# Altium project PID_Controller.PrjPcb
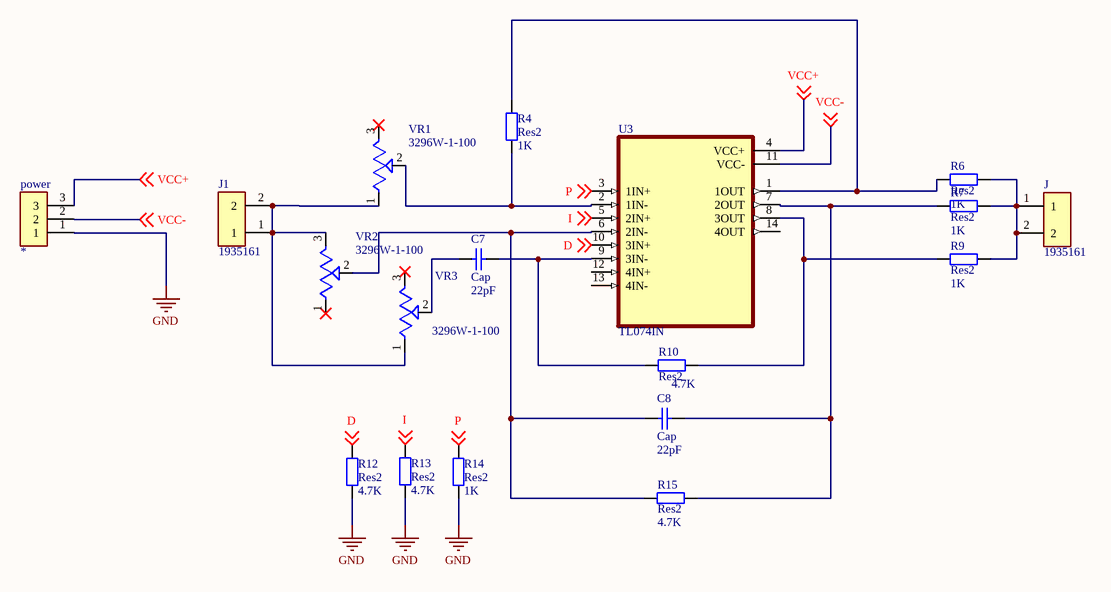
[diagram p0: PID_controller.SchDoc]
1 sheet, 18 parts. Net scope: global (net labels, ports and power ports of the same name join across sheets).
Board file: PID_controller.PcbDoc

## Sheet PID_controller.SchDoc
size A4

### Parts
C7  Cap  value 22pF  [RAD-0.3]
C8  Cap  value 22pF  [RAD-0.3]
J  1935161  [PHOENIX_1935161]
J1  1935161  [PHOENIX_1935161]
power  282837-3  [TE_282837-3]  (value not drawn)
R4  Res2  value 1K  [AXIAL-0.4]
R6  Res2  value 1K  [AXIAL-0.4]
R7  Res2  value 1K  [AXIAL-0.4]
R9  Res2  value 1K  [AXIAL-0.4]
R10  Res2  value 4.7K  [AXIAL-0.4]
R12  Res2  value 4.7K  [AXIAL-0.4]
R13  Res2  value 4.7K  [AXIAL-0.4]
R14  Res2  value 1K  [AXIAL-0.4]
R15  Res2  value 4.7K  [AXIAL-0.4]
U3  TL074IN  [DIP794W45P254L1969H508Q14]
VR1  3296W-1-100  [TRIM_3296W-1-100]
VR2  3296W-1-100  [TRIM_3296W-1-100]
VR3  3296W-1-100  [TRIM_3296W-1-100]

### Nets
GND: power.1 R12.1 R13.1 R14.1
D: R12.2 U3.10(3IN+) ; off-sheet D
I: R13.2 U3.5(2IN+) ; off-sheet I
P: R14.2 U3.3(1IN+) ; off-sheet P
VCC+: power.3 U3.4(VCC+) ; off-sheet VCC+
VCC-: power.2 U3.11(VCC-) ; off-sheet VCC-
NetC7_1: C7.1 VR3.2(WIPER)
NetC7_2: C7.2 R10.1 U3.9(3IN-)
NetC8_1: C8.1 R15.2 U3.6(2IN-) VR2.2(WIPER)
NetC8_2: C8.2 R7.1 R15.1 U3.7(2OUT)
NetJ1_1: J1.1 J1.2 VR1.1(CCW) VR2.3(CW) VR3.1(CCW)
NetJ_1: J.1 J.2 R6.2 R7.2 R9.2
NetR4_1: R4.1 U3.2(1IN-) VR1.2(WIPER)
NetR4_2: R4.2 R6.1 U3.1(1OUT)
NetR9_1: R9.1 R10.2 U3.8(3OUT)

Not connected (* = marked no-connect by the designer): U3 12(4IN+) 13(4IN-) 14(4OUT); VR1 3(CW)*; VR2 1(CCW)*; VR3 3(CW)*

### Library data of the parts
C7 C8 = Cap: Capacitor; Published: 8-Jun-2000; LatestRevisionDate: 17-Jul-2002; LatestRevisionNote: Re-released for DXP Platform.; PackageReference: RAD-0.3; Publisher: Altium Limited; PackageDescription: Radial Cap, Thru-Hole; 2 Leads; 0.3 in Pin Spacing
J J1 = 1935161: 2 Position Wire to Board Terminal Block Horizontal with Board 0.197 _5.00mm_ Through Hole; MF: Phoenix Contact; SnapEDA_Link: https://www.snapeda.com/parts/1935161/Phoenix%20Contact/view-part/423515/?ref=snap; MP: 1935161; Value: *; Digi-Key_Purchase_URL: https://www.digikey.ca/product-detail/en/phoenix-contact/1935161/277-1667-ND/568614?utm_source=snapeda&utm_medium=aggregator&utm_campaign=symbol; Digi-Key_Part_Number: 277-1667-ND; Package: None
power = 282837-3: Wire to Board 3 Position 5.08 mm Pitch 30-16 AWG Euro Style Terminal Block; MF: TE Connectivity; Package: None; Digi-Key_Purchase_URL: https://www.digikey.in/product-detail/en/te-connectivity-amp-connectors/282837-3/A113321-ND/2187974?utm_source=snapeda&utm_medium=aggregator&utm_campaign=symbol; Digi-Key_Part_Number: A113321-ND; Value: *; MP: 282837-3; TE_purchase_URL: https://www.te.com/usa-en/product-282837-3.html?te_bu=Cor&te_type=disp&te_campaign=seda_glo_cor-seda-global-disp-prtnr-fy19-seda-model-bom-cta_sma-317_1&elqCampaignId=32493; SnapEDA_Link: https://www.snapeda.com/parts/282837-3/TE%20Connectivity%20AMP%20Connectors/view-part/2765182/?ref=snap; Comment_1: *
R4 R6 R7 R9 R10 R12-R15 = Res2: Resistor; Published: 8-Jun-2000; LatestRevisionDate: 17-Jul-2002; LatestRevisionNote: Re-released for DXP Platform.; PackageReference: AXIAL-0.4; Publisher: Altium Limited; PackageDescription: Axial Device, Thru-Hole; 2 Leads; 0.4 in Pin Spacing
U3 = TL074IN: J-FET Amplifier 4 Circuit 14-DIP; MF: STMicroelectronics; Price: None; SnapEDA_Link: https://www.snapeda.com/parts/TL074IN/STMicroelectronics/view-part/481259/?ref=snap; Check_prices: https://www.snapeda.com/parts/TL074IN/STMicroelectronics/view-part/481259/?ref=eda; Purchase-URL: https://pricing.snapeda.com/search/part/TL074IN/?ref=eda; Value: *; MP: TL074IN; Package: DIP-14 Texas Instruments; Availability: Good
VR1-VR3 = 3296W-1-100: 10 Ohms 0.5W, 1/2W PC Pins Through Hole Trimmer Potentiometer Cermet 25 Turn Top Adjustment; MF: Bourns; Mouser-Purchase-URL: https://snapeda.com/shop?store=Mouser&id=1463245; Value: *; SnapEDA_Link: https://www.snapeda.com/parts/3296W-1-100/Bourns/view-part/1463245/?ref=snap; MP: 3296W-1-100; Package: SOT-23-5 Bourns; Digi-Key_Part_Number: 3296W-100LF-ND